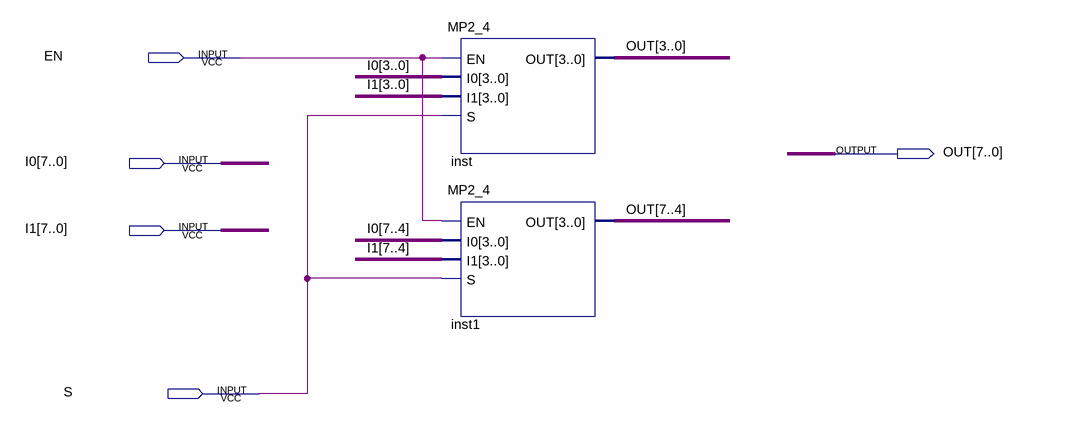
[diagram p0: schematic sheet]
// Quartus schematic MP2_8.bdf as structural Verilog: 2 symbols, 5 pins
module MP2_8 (
  input  EN,
  input  [7:0] I0,
  input  [7:0] I1,
  input  S,
  output [7:0] OUT
);

  MP2_4 inst (.EN(EN), .I0(I0[3:0]), .I1(I1[3:0]), .S(S), .OUT(OUT[3:0]));
  MP2_4 inst1 (.EN(EN), .I0(I0[7:4]), .I1(I1[7:4]), .S(S), .OUT(OUT[7:4]));
endmodule
